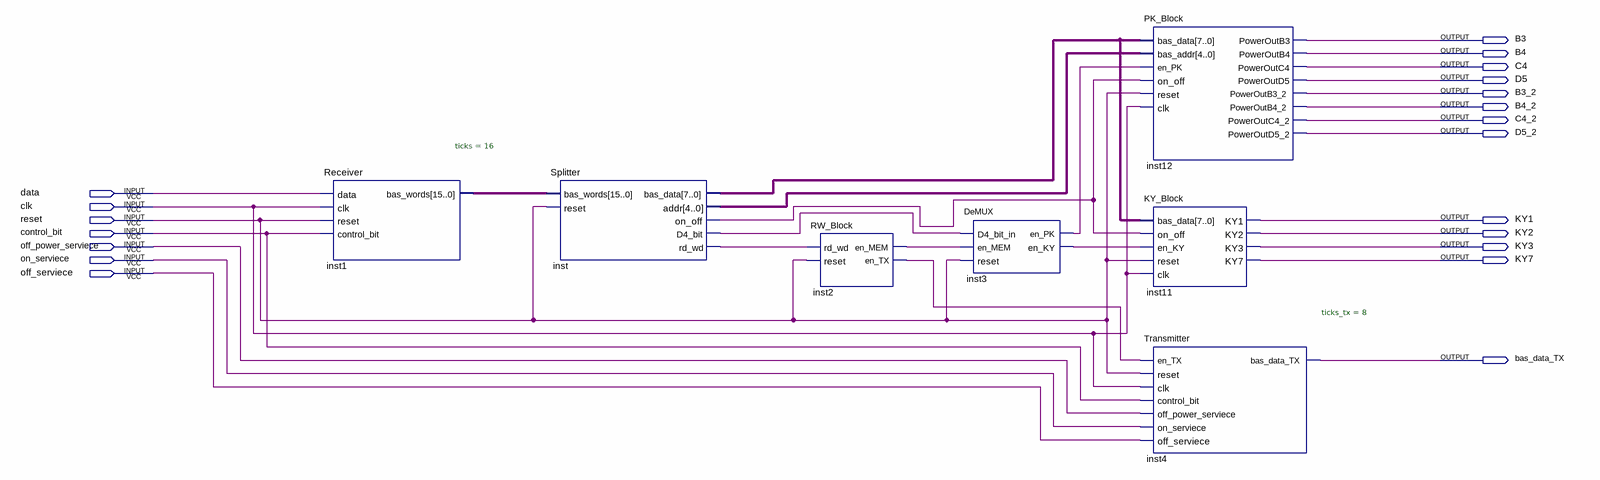
[diagram p0: schematic sheet]
// Quartus schematic ArchFLT.bdf as structural Verilog: 7 symbols, 20 pins
module ArchFLT (
  input  data,
  input  clk,
  input  reset,
  input  control_bit,
  input  off_power_serviece,
  input  on_serviece,
  input  off_serviece,
  output B3,
  output B4,
  output C4,
  output D5,
  output B3_2,
  output B4_2,
  output C4_2,
  output D5_2,
  output KY1,
  output KY2,
  output KY3,
  output KY7,
  output bas_data_TX
);

  wire inst2_en_mem, inst2_en_tx, inst3_en_ky, inst3_en_pk, inst_d4_bit, inst_on_off, inst_rd_wd;
  wire [4:0] inst_addr;
  wire [7:0] inst_bas_data;
  wire [15:0] inst1_bas_words;

  Receiver #(.ticks(16)) inst1 (
    .data(data), .clk(clk), .reset(reset), .control_bit(control_bit), .bas_words(inst1_bas_words));
  Splitter inst (
    .bas_words(inst1_bas_words), .reset(reset), .bas_data(inst_bas_data), .addr(inst_addr),
    .on_off(inst_on_off), .D4_bit(inst_d4_bit), .rd_wd(inst_rd_wd));
  RW_Block inst2 (.rd_wd(inst_rd_wd), .reset(reset), .en_MEM(inst2_en_mem), .en_TX(inst2_en_tx));
  DeMUX inst3 (.D4_bit_in(inst_d4_bit), .en_MEM(inst2_en_mem), .reset(reset), .en_PK(inst3_en_pk), .en_KY(inst3_en_ky));
  PK_Block inst12 (
    .bas_data(inst_bas_data), .bas_addr(inst_addr), .en_PK(inst3_en_pk), .on_off(inst_on_off), .reset(reset),
    .clk(clk), .PowerOutB3(B3), .PowerOutB4(B4), .PowerOutC4(C4), .PowerOutD5(D5), .PowerOutB3_2(B3_2),
    .PowerOutB4_2(B4_2), .PowerOutC4_2(C4_2), .PowerOutD5_2(D5_2));
  KY_Block inst11 (
    .bas_data(inst_bas_data), .on_off(inst_on_off), .en_KY(inst3_en_ky), .reset(reset), .clk(clk), .KY1(KY1),
    .KY2(KY2), .KY3(KY3), .KY7(KY7));
  Transmitter #(.ticks_tx(8)) inst4 (
    .en_TX(inst2_en_tx), .reset(reset), .clk(clk), .control_bit(control_bit),
    .off_power_serviece(off_power_serviece), .on_serviece(on_serviece), .off_serviece(off_serviece),
    .bas_data_TX(bas_data_TX));
endmodule
